# EAGLE design encoder (EAGLE 8.6.2)
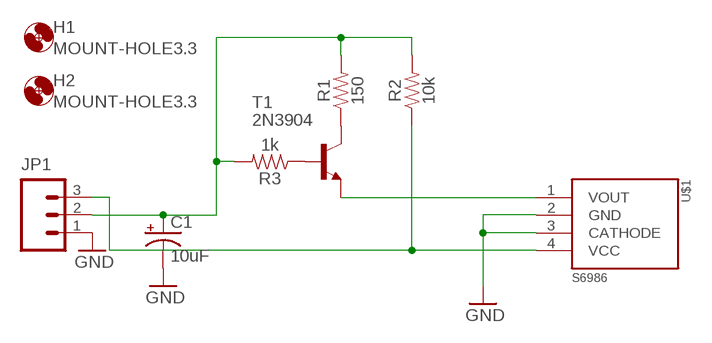
[diagram p0: schematic, sheet 1]

## Parts
C1  10uF  10UF-POLAR-RADIAL-2.5MM-KIT-25V-20%  [CPOL-RADIAL-2.5MM-5MM-KIT]
H1  MOUNT-HOLE3.3  [3,3]
H2  MOUNT-HOLE3.3  [3,3]
JP1  M03PTH  [1X03]
R1  150  10OHM-HORIZ-1/4W-1%  [AXIAL-0.3]
R2  10k  10OHM-HORIZ-1/4W-1%  [AXIAL-0.3]
R3  1k  10OHM-HORIZ-1/4W-1%  [AXIAL-0.3]
T1  2N3904  [TO92]
U$1  S6986  [S6986]

## Nets
GND: C1.2(-) JP1.1 U$1.2(GND) U$1.3(CATHODE)
N$1: C1.1(+) JP1.2 R1.P$2 R2.P$2 R3.P$2
N$3: JP1.3 R2.P$1 U$1.4(VCC)
N$4: R1.P$1 T1.1(C)
N$5: R3.P$1 T1.2(B)
N$6: T1.3(E) U$1.1(VOUT)

## Library data of the parts
C1 = SparkFun-Capacitors:10UF-POLAR: 10.0µF polarized capacitors A capacitor is a passive two-terminal electrical component used to store electrical energy temporarily in an electric field.; PROD_ID: CAP-08440
H1 H2 = holes:MOUNT-HOLE: MOUNTING HOLE with drill center marker
JP1 = ee192:M03: 3-pin 0.1-inch header and MTA connector Courtsey of Pioneers in Engineering; PIE-INT-REF-NUM: BULK-STOCK
R1-R3 = SparkFun-Resistors:10OHM: 10Ω resistor A resistor is a passive two-terminal electrical component that implements electrical resistance as a circuit element. Resistors act to reduce current flow, and, at the same time, act to lower voltage levels within circuits. - Wikipedia; PROD_ID: RES-12180; VALUE: 10
T1 = transistor:2N3904: NPN TRANSISTOR
U$1 = ee192:S6986: Hamamatsu S6986 Light Modulation Photo ICs 4 pin SIP

## Board
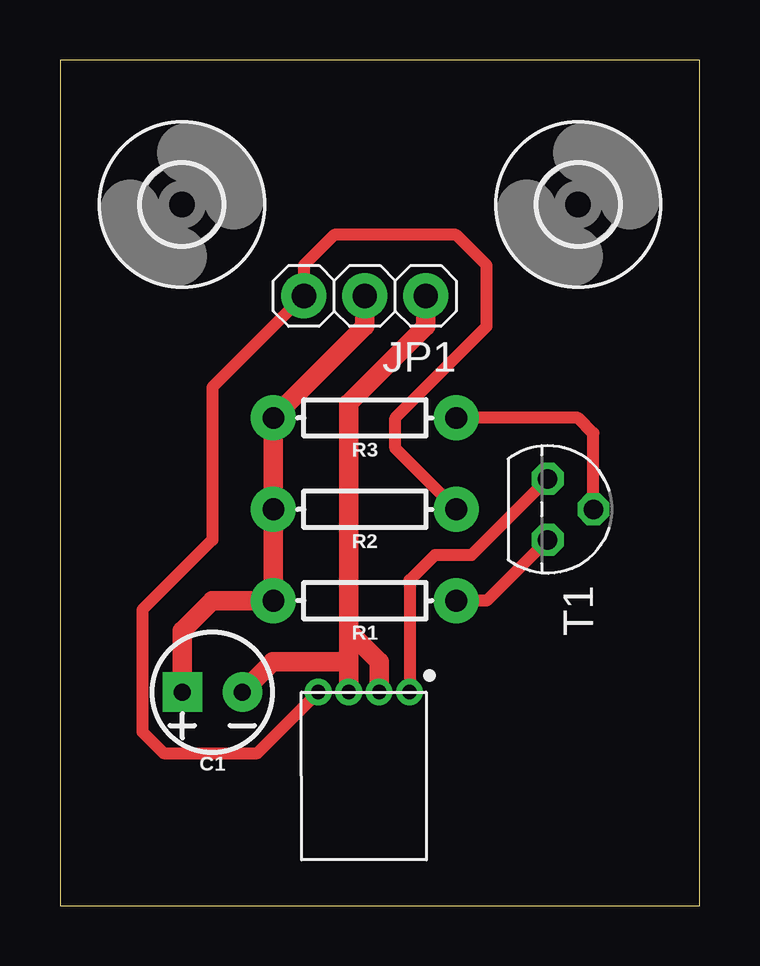
[diagram p1: board, top side]

Size 26.65 x 35.23 mm. Coordinates in mm from the lower left corner, seen from the top.
Outline: 0,0 26.65,0 26.65,35.23 0,35.23 0,0
Copper layers (1*16): Top 0.035mm / dielectric 1.5mm / Bottom 0.035mm
Design rules "default": minimum track width 6mil, minimum drill 0.35mm, track to track 6mil, track to pad 6mil, pad to pad 6mil, via to via 6mil, smd to smd 6mil, copper to edge 40mil, drill to drill 6mil, minimum pad ring 10mil, minimum via ring 8mil, stop-mask expansion 4mil, vias tented up to drill 0mil, thermal gap 10mil

### Footprints (pad centres in the part's own frame; a part is rotated, then mirrored left to right if it is on the bottom)
CPOL-RADIAL-2.5MM-5MM-KIT = drill 0.7 pad 1.651 square: 1 1.25,0 | drill 0.7 pad 1.651: 2 -1.25,0
3,3 = hole 3.3: 0,0
1X03 = drill 1.016 pad 1.88: 1 -2.54,0; 2 0,0; 3 2.54,0
AXIAL-0.3 = drill 0.9 pad 1.88: P$1 -3.81,0; P$2 3.81,0
TO92 = drill 0.813 octagon: 1 1.27,0; 2 0,1.905; 3 -1.27,0
S6986 = drill 0.6: 1 -1.87,0; 2 -0.6,0; 3 0.67,0; 4 1.94,0

### Placement (x,y rotation side)
C1  6.35,8.89 180 top
H1  5.08,29.21 0 top
H2  21.59,29.21 0 top
JP1  12.7,25.4 180 top
R1  12.7,12.7 180 top
R2  12.7,16.51 180 top
R3  12.7,20.32 180 top
T1  20.32,16.51 270 top
U$1  12.7,8.89 180 top

### Tracks (layer width: path | path; a pad name or v marks a point on that pad's centre or on a via)
GND
  Top 0.813: JP1.1 15.24,24.13 12.03,20.92 12.03,11.43 | 12.03,11.43 12.03,10.16 | 12.03,10.16 U$1.3 | U$1.2 13.3,10.16 12.03,11.43 | C1.2 8.87,10.16 12.03,10.16
N$1
  Top 0.813: JP1.2 12.7,24.13 R3.P$2 R2.P$2 R1.P$2 6.35,12.7 5.1,11.45 C1.1
N$3
  Top 0.508: R2.P$1 13.97,19.05 13.97,20.32 17.78,24.13 17.78,26.67 16.51,27.94 11.43,27.94 10.16,26.67 JP1.3 6.35,21.59 6.35,15.24 3.43,12.32 3.43,7.24 4.32,6.35 8.22,6.35 U$1.4
N$4
  Top 0.508: T1.1 17.78,12.7 R1.P$1
N$5
  Top 0.508: T1.2 22.23,19.68 21.59,20.32 R3.P$1
N$6
  Top 0.508: T1.3 17.14,14.6 15.62,14.6 14.57,13.55 U$1.1